# EAGLE design ASM4001 (EAGLE 6.3)
DATABASE: ./../../../../../Components/TinyCircuits_Part_Database.txt

## Sheet 1 of 2
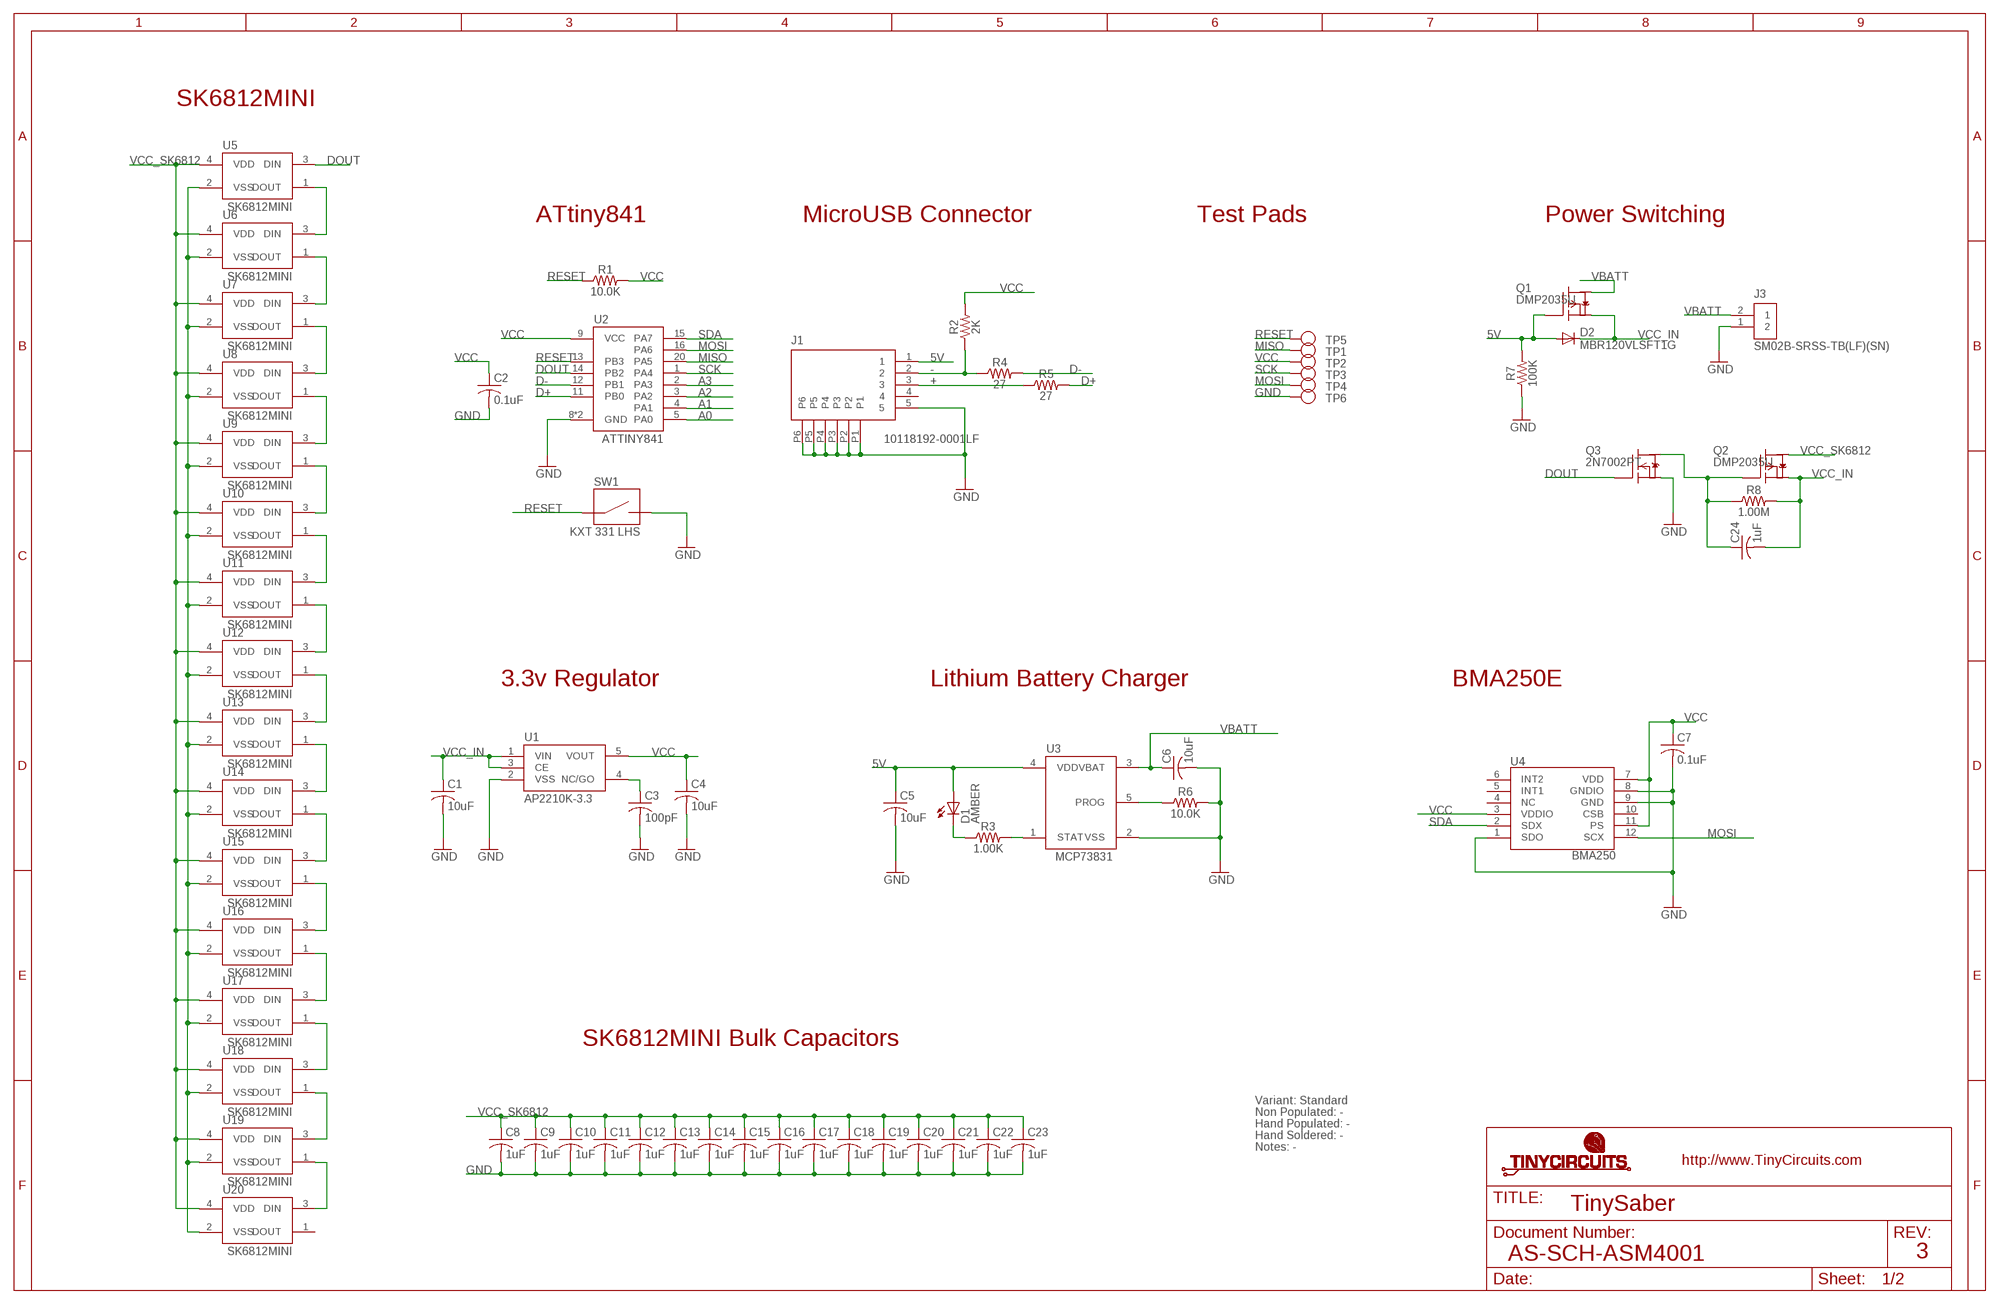
[diagram p0: schematic, sheet 1]

### Parts
C1  10uF  AS-ITM-00002  [C0603]
C2  0.1uF  AS-ITM-00008  [C0402]
C3  100pF  AS-ITM-00148  [0402]
C4  10uF  AS-ITM-00002  [C0603]
C5  10uF  AS-ITM-00002  [C0603]
C6  10uF  AS-ITM-00002  [C0603]
C7  0.1uF  AS-ITM-00008  [C0402]
C8  1uF  AS-ITM-00410  [C0603]
C9  1uF  AS-ITM-00410  [C0603]
C10  1uF  AS-ITM-00410  [C0603]
C11  1uF  AS-ITM-00410  [C0603]
C12  1uF  AS-ITM-00410  [C0603]
C13  1uF  AS-ITM-00410  [C0603]
C14  1uF  AS-ITM-00410  [C0603]
C15  1uF  AS-ITM-00410  [C0603]
C16  1uF  AS-ITM-00410  [C0603]
C17  1uF  AS-ITM-00410  [C0603]
C18  1uF  AS-ITM-00410  [C0603]
C19  1uF  AS-ITM-00410  [C0603]
C20  1uF  AS-ITM-00410  [C0603]
C21  1uF  AS-ITM-00410  [C0603]
C22  1uF  AS-ITM-00410  [C0603]
C23  1uF  AS-ITM-00410  [C0603]
C24  1uF  AS-ITM-00105  [C0402]
D1  AMBER  AS-ITM-00058  [0402_LED]
D2  MBR120VLSFT1G  AS-ITM-00111  [SOD-123FL]
J1  10118192-0001LF  AS-ITM-00021A  [MICRO_USB_ALT]
J3  SM02B-SRSS-TB(LF)(SN)  AS-ITM-00231  [JST_SH_2X1]
Q1  DMP2035U  AS-ITM-00024  [SOT23]
Q2  DMP2035U  AS-ITM-00024A  [SOT23A]
Q3  2N7002PT  AS-ITM-00110  [SOT-416]
R1  10.0K  AS-ITM-00032  [0402]
R2  2K  AS-ITM-00315  [0402]
R3  1.00K  AS-ITM-00003  [0402]
R4  27  AS-ITM-00240  [0402]
R5  27  AS-ITM-00240  [0402]
R6  10.0K  AS-ITM-00032  [0402]
R7  100K  AS-ITM-00004  [0402]
R8  1.00M  AS-ITM-00005  [0402]
SW1  KXT 331 LHS  AS-ITM-00372  [KXT_LHS]
TP1  TEST_POINT  [TEST_POINT_1MM]
TP2  TEST_POINT  [TEST_POINT_1MM]
TP3  TEST_POINT  [TEST_POINT_1MM]
TP4  TEST_POINT  [TEST_POINT_1MM]
TP5  TEST_POINT  [TEST_POINT_1MM]
TP6  TEST_POINT  [TEST_POINT_1MM]
U1  AP2210K-3.3  AS-ITM-00344  [SOT-25]
U2  ATTINY841  AS-ITM-00255  [VQFN-20]
U3  MCP73831  AS-ITM-00136  [SOT-23]
U4  BMA250  AS-ITM-00070  [3-AXIS_ACCELEROMETER]
U5  SK6812MINI  AS-ITM-00343  [SK6812MINI]
U6  SK6812MINI  AS-ITM-00343  [SK6812MINI]
U7  SK6812MINI  AS-ITM-00343  [SK6812MINI]
U8  SK6812MINI  AS-ITM-00343  [SK6812MINI]
U9  SK6812MINI  AS-ITM-00343  [SK6812MINI]
U10  SK6812MINI  AS-ITM-00343  [SK6812MINI]
U11  SK6812MINI  AS-ITM-00343  [SK6812MINI]
U12  SK6812MINI  AS-ITM-00343  [SK6812MINI]
U13  SK6812MINI  AS-ITM-00343  [SK6812MINI]
U14  SK6812MINI  AS-ITM-00343  [SK6812MINI]
U15  SK6812MINI  AS-ITM-00343  [SK6812MINI]
U16  SK6812MINI  AS-ITM-00343  [SK6812MINI]
U17  SK6812MINI  AS-ITM-00343  [SK6812MINI]
U18  SK6812MINI  AS-ITM-00343  [SK6812MINI]
U19  SK6812MINI  AS-ITM-00343  [SK6812MINI]
U20  SK6812MINI  AS-ITM-00343  [SK6812MINI]

### Nets
5V: C5.1 D1.1(A) D2.A J1.1 Q1.B(G) R7.2 U3.4(VDD)
+: J1.3 R5.1
-: J1.2 R2.1 R4.1
A0: U2.5(PA0)
A1: U2.4(PA1)
A2: U2.3(PA2)
A3: U2.2(PA3)
D+: R5.2 U2.11(PB0)
D-: R4.2 U2.12(PB1)
DOUT: Q3.1(G) U2.14(PB2) U5.3(DIN)
GND: C1.2 C2.2 C3.2 C4.2 C5.2 C6.2 C7.2 C8.2 C9.2 C10.2 C11.2 C12.2 C13.2 C14.2 C15.2 C16.2 C17.2 C18.2 C19.2 C20.2 C21.2 C22.2 C23.2 J1.5 J1.P1 J1.P2 J1.P3 J1.P4 J1.P5 J1.P6 J3.1 Q3.2(S) R6.2 R7.1 SW1.2 TP6.P$1 U1.2(VSS) U2.8(GND) U2.PAD(GND) U3.2(VSS) U4.1(SDO) U4.8(GNDIO) U4.9(GND) U5.2(VSS) U6.2(VSS) U7.2(VSS) U8.2(VSS) U9.2(VSS) U10.2(VSS) U11.2(VSS) U12.2(VSS) U13.2(VSS) U14.2(VSS) U15.2(VSS) U16.2(VSS) U17.2(VSS) U18.2(VSS) U19.2(VSS) U20.2(VSS)
MISO: TP1.P$1 U2.20(PA5)
MOSI: TP4.P$1 U2.16(PA6) U4.12(SCX)
N$1: C3.1 U1.4(NC/GO)
N$2: U17.1(DOUT) U18.3(DIN)
N$3: U18.1(DOUT) U19.3(DIN)
N$4: U6.1(DOUT) U7.3(DIN)
N$5: C24.1 Q2.B(G) Q3.3(D) R8.1
N$6: U19.1(DOUT) U20.3(DIN)
N$7: R6.1 U3.5(PROG)
N$9: U5.1(DOUT) U6.3(DIN)
N$10: U7.1(DOUT) U8.3(DIN)
N$13: U8.1(DOUT) U9.3(DIN)
N$14: R3.2 U3.1(STAT)
N$15: D1.2(C) R3.1
N$16: U9.1(DOUT) U10.3(DIN)
N$19: U10.1(DOUT) U11.3(DIN)
N$22: U11.1(DOUT) U12.3(DIN)
N$25: U12.1(DOUT) U13.3(DIN)
N$28: U13.1(DOUT) U14.3(DIN)
N$31: U14.1(DOUT) U15.3(DIN)
N$34: U15.1(DOUT) U16.3(DIN)
N$37: U16.1(DOUT) U17.3(DIN)
RESET: R1.1 SW1.1 TP5.P$1 U2.13(PB3)
SCK: TP3.P$1 U2.1(PA4)
SDA: U2.15(PA7) U4.2(SDX)
VBATT: C6.1 J3.2 Q1.C(D) U3.3(VBAT)
VCC: C2.1 C4.1 C7.1 R1.2 R2.2 TP2.P$1 U1.5(VOUT) U2.9(VCC) U4.3(VDDIO) U4.7(VDD) U4.11(PS)
VCC_IN: C1.1 C24.2 D2.C Q1.E(S) Q2.E(S) R8.2 U1.1(VIN) U1.3(CE)
VCC_SK6812: C8.1 C9.1 C10.1 C11.1 C12.1 C13.1 C14.1 C15.1 C16.1 C17.1 C18.1 C19.1 C20.1 C21.1 C22.1 C23.1 Q2.C(D) U5.4(VDD) U6.4(VDD) U7.4(VDD) U8.4(VDD) U9.4(VDD) U10.4(VDD) U11.4(VDD) U12.4(VDD) U13.4(VDD) U14.4(VDD) U15.4(VDD) U16.4(VDD) U17.4(VDD) U18.4(VDD) U19.4(VDD) U20.4(VDD)
Unconnected: J1.4 U4.4(NC) U4.5(INT1) U4.6(INT2) U4.10(CSB) U20.1(DOUT)

### Notes on the sheet
- SK6812MINI
- ATtiny841 | MicroUSB Connector | Test Pads | Power Switching
- 3.3v Regulator | Lithium Battery Charger | BMA250E
- SK6812MINI Bulk Capacitors
- Variant: Standard
- Non Populated: -
- Hand Populated: -
- Hand Soldered: -
- Notes: -
- TinySaber
- AS-SCH-ASM4001 | 3

## Sheet 2 of 2

## Library data of the parts
C1 C4-C6 = tinycircuits:AS-ITM-00002: CAP CER 10UF 10V 20% X5R 0603; PARTNO: AS-ITM-00002
C2 C7 = tinycircuits:AS-ITM-00008: CAP CER 0.1UF 16V 10% X5R 0402; PARTNO: AS-ITM-00008
C3 = tinycircuits:AS-ITM-00148: CAP CER 100PF 50V 5% NPO 0402; PARTNO: AS-ITM-00148
C8-C23 = tinycircuits:AS-ITM-00410: CAP CER 1UF 10V X5R 0603; PARTNO: AS-ITM-00410
C24 = tinycircuits:AS-ITM-00105: CAP CER 1UF 6.3V 10% X5R 0402; PARTNO: AS-ITM-00105
D1 = tinycircuits:AS-ITM-00058: LED 0402 AMBER WTR CLR SMD; PARTNO: AS-ITM-00058
D2 = tinycircuits:AS-ITM-00111: DIODE SCHOTTKY 20V 1A SOD123L; PARTNO: AS-ITM-00111
J1 = tinycircuits:AS-ITM-00021: CONN RCPT 5POS MICRO USB R/A; PARTNO: AS-ITM-00021; PNPROTATION: 90
J3 = tinycircuits:AS-ITM-00231: CONN HEADER SH 2POS SIDE 1MM; PARTNO: AS-ITM-00231; PNPROTATION: 180
Q1 = tinycircuits:AS-ITM-00024: P-Channel MOSFET SOT-23; PARTNO: AS-ITM-00024; PNPROTATION: 0
Q2 = tinycircuits:AS-ITM-00024: P-Channel MOSFET SOT-23; PARTNO: AS-ITM-00024
Q3 = tinycircuits:AS-ITM-00110: MOSFET N-CH SGL 60V SOT-416; PARTNO: AS-ITM-00110
R1 R6 = tinycircuits:AS-ITM-00032: RES 10.0K OHM 1/16W 1% 0402 SMD; PARTNO: AS-ITM-00032
R2 = tinycircuits:AS-ITM-00315: RES SMD 2K OHM 1% 1/16W 0402; PARTNO: AS-ITM-00315
R3 = tinycircuits:AS-ITM-00003: RES 1.00K OHM 1/16W 1% 0402; PARTNO: AS-ITM-00003
R4 R5 = tinycircuits:AS-ITM-00240: RES 27 OHM 1/16W 5% 0402 SMD; PARTNO: AS-ITM-00240; VALUE: 27.0
R7 = tinycircuits:AS-ITM-00004: RES 100K OHM 1/16W 1% 0402; PARTNO: AS-ITM-00004
R8 = tinycircuits:AS-ITM-00005: RES 1.00M OHM 1/16W 1% 0402; PARTNO: AS-ITM-00005
SW1 = tinycircuits:AS-ITM-00372: SWITCH TACTILE SPST-NO 0.02A 15V; PARTNO: AS-ITM-00372
TP1-TP6 = tinycircuits:TEST_POINT: Test point, no drill
U1 = tinycircuits:AS-ITM-00344: IC REG LDO 3.3V 0.3A SOT25; PARTNO: AS-ITM-00344; PNPROTATION: 270; VALUE: AP2210K-3.3TRG1
U2 = tinycircuits:AS-ITM-00255: IC MCU 8BIT 8KB FLASH 20VQFN; PARTNO: AS-ITM-00255
U3 = tinycircuits:AS-ITM-00136: IC CONTROLLER LI-ION 4.2V SOT23-5; PARTNO: AS-ITM-00136; PNPROTATION: 270
U4 = tinycircuits:AS-ITM-00070: 3-AXIS ACCELEROMOETER; PARTNO: AS-ITM-00070; PNPROTATION: 90
U5-U20 = tinycircuits:AS-ITM-00343: RGB LED WITH DRIVER MINI 3535; PARTNO: AS-ITM-00343

## Board
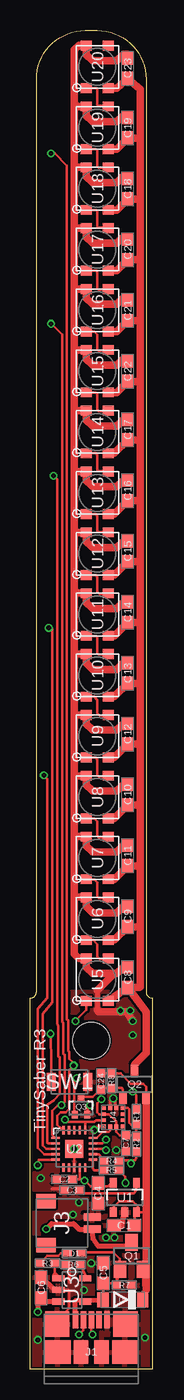
[diagram p1: board, top side]
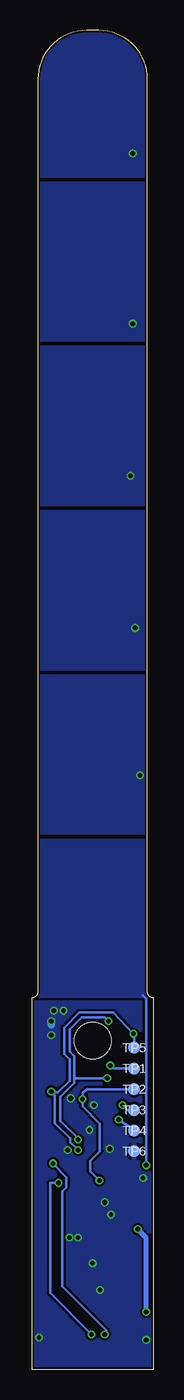
[diagram p2: board, bottom side, seen from below]

Size 10 x 110 mm. Coordinates in mm from the lower left corner, seen from the top.
Outline: 0.5,106 arc-90 4.5,110 5.5,110 arc-90 9.5,106 9.5,31 arc90 10,30.5 10,0 0,0 0,30.5 arc90 0.5,31 0.5,106
Copper layers (1*16): Top 0.035mm / dielectric 1.5mm / Bottom 0.035mm
Design rules "default *": minimum track width 7mil, minimum drill 15mil, track to track 7mil, track to pad 7mil, pad to pad 7mil, via to via 7mil, smd to smd 7mil, copper to edge 7mil, drill to drill 8mil, minimum pad ring 8mil, minimum via ring 5mil, stop-mask expansion 4mil, vias tented up to drill 25mil, thermal gap 10mil
Holes 3 mm at 5,27
tRestrict: 5 lines

### Footprints (pad centres in the part's own frame; a part is rotated, then mirrored left to right if it is on the bottom)
C0603 = smd 1.1 x 1: 1 -0.85,0; 2 0.85,0
C0402 = smd 0.65 x 0.6: 1 -0.65,0; 2 0.65,0
0402 = smd 0.65 x 0.55: 1 -0.6,0; 2 0.6,0
0402_LED = smd 0.7 x 0.5: 1 -0.55,0; 2 0.55,0
SOD-123FL = smd 0.914 x 1.219: A 1.638,0; C -1.638,0
MICRO_USB_ALT = smd 1.38 x 0.45: 1 2.66,1.3; 2 2.66,0.65; 3 2.66,0; 4 2.66,-0.65; 5 2.66,-1.3 | smd 2.1 x 2: P1 2.3,-2.8; P2 2.3,2.8 | smd 1.9 x 2.1: P3 0,2.75; P4 0,-2.75 | smd 1.9 x 1.175: P5 0,0.838; P6 0,-0.838
JST_SH_2X1 = smd 0.6 x 1.4: 1 -0.5,2.475; 2 0.5,2.475 | smd 1.2 x 1.6: PAD1 -1.8,-1.325; PAD2 1.8,-1.325
SOT23 = smd 1 x 1.4: B -0.95,-1.1; C 0,1.1; E 0.95,-1.1
SOT23A = smd 0.6 x 1: B -0.95,-1.1; C 0,1.1; E 0.95,-1.1
SOT-416 = smd 0.5 x 0.6: 1 -0.5,-0.65; 2 0.5,-0.65; 3 0,0.65
KXT_LHS = smd 1.5 x 0.75: 1 0,1.5; 2 0,-1.5
TEST_POINT_1MM = smd 1 x 1: P$1 0,0
SOT-25 = smd 0.55 x 0.8: 1 -0.95,-1.2; 2 0,-1.2; 3 0.95,-1.2; 4 0.95,1.2; 5 -0.95,1.2
VQFN-20 = smd 0.7 x 0.2: 1 -1.55,0.9; 2 -1.55,0.45; 3 -1.55,0; 4 -1.55,-0.45; 5 -1.55,-0.9; 11 1.55,-0.9; 12 1.55,-0.45; 13 1.55,0; 14 1.55,0.45; 15 1.55,0.9 | smd 0.2 x 0.7: 6 -0.9,-1.55; 7 -0.45,-1.55; 8 0,-1.55; 9 0.45,-1.55; 10 0.9,-1.55; 16 0.9,1.55; 17 0.45,1.55; 18 0,1.55; 19 -0.45,1.55; 20 -0.9,1.55 | smd 1.5 x 1.5: PAD 0,0
SOT-23 = smd 0.5 x 1: 1 -0.95,-1.1; 2 0,-1.1; 3 0.95,-1.1; 4 0.95,1.1; 5 -0.95,1.1
3-AXIS_ACCELEROMETER = smd 0.3 x 0.35: 1 -0.75,0.775; 4 -0.75,-0.775; 5 -0.25,-0.775; 6 0.25,-0.775; 7 0.75,-0.775; 10 0.75,0.775; 11 0.25,0.775; 12 -0.25,0.775 | smd 0.35 x 0.3: 2 -0.775,0.25; 3 -0.775,-0.25; 8 0.775,-0.25; 9 0.775,0.25
SK6812MINI = smd 0.8 x 0.9: 1 -1.75,0.9; 2 -1.75,-0.9; 3 1.75,-0.9; 4 1.75,0.9

### Placement (x,y rotation side)
C1  7.7,11.8 180 top
C2  2.8,15.6 180 top
C3  3.4,14.7 180 top
C4  5.55,14.45 270 top
C5  6,7.9 90 top
C6  0.9,6.7 90 top
C7  7.85,18.55 270 top
C8  8,32.2 90 top
C9  8,37.2 90 top
C10  8,47.2 90 top
C11  8,42.2 90 top
C12  8,52.2 90 top
C13  8,57.2 90 top
C14  8,62.2 90 top
C15  8,67.2 90 top
C16  8,72.2 90 top
C17  8,77.2 90 top
C18  8,97 90 top
C19  8,102 90 top
C20  8,92 90 top
C21  8,87 90 top
C22  8,82 90 top
C23  8,106.9 90 top
C24  5.8,23.65 90 top
D1  3.6,9.5 180 top
D2  7.6,5.7 180 top
J1  5,1.4 90 top
J3  2.6,12 270 top
Q1  8.3,9.3 0 top
Q2  8.55,23.4 0 top
Q3  4.15,21.55 0 top
R1  8.7,20.75 270 top
R2  8.7,18.5 90 top
R3  1.4,8.7 0 top
R4  6.65,17.1 180 top
R5  6.65,16.35 180 top
R6  3.5,8.6 180 top
R7  7.7,6.9 180 top
R8  6.65,23.7 90 top
SW1  3.2,23.6 90 top
TP1  1.6,24.7 0 bottom
TP2  1.6,23 0 bottom
TP3  1.6,21.3 0 bottom
TP4  1.6,19.6 0 bottom
TP5  1.6,26.4 0 bottom
TP6  1.6,17.9 0 bottom
U1  7.75,14.1 0 top
U2  3.6,18.1 0 top
U3  3.4,6.5 270 top
U4  6.8,20.7 90 top
U5  5.5,32 270 top
U6  5.5,37 270 top
U7  5.5,42 270 top
U8  5.5,47 270 top
U9  5.5,52 270 top
U10  5.5,57 270 top
U11  5.5,62 270 top
U12  5.5,67 270 top
U13  5.5,72 270 top
U14  5.5,77 270 top
U15  5.5,82 270 top
U16  5.5,87 270 top
U17  5.5,92 270 top
U18  5.5,97 270 top
U19  5.5,102 270 top
U20  5.5,107 270 top
U$1  [DOCFIELD-TINYCIRCUITS-PCB]  22,-2 0 top  (outside the outline)

### Tracks (layer width: path | path; a pad name or v marks a point on that pad's centre or on a via)
5V
  Top 0.203: Q1.B 7.35,9.05 6.8,9.6 4.25,9.6 D1.1 | Q1.B 7.1,7.05 C5.1 5.96,7.01 D2.A | 3.7,5.64 4.41,5.64 U3.4 | R7.2 7.1,7.95 Q1.B
  Top 0.406: J1.1 3.7,5.64 D2.A
+  (via drill 0.38)
  Top 0.203: v5.1,2.85 5,2.95 J1.3 | R5.1 7.8,15.8 v7.8,15.3
  Bottom 0.203: v7.8,15.3 8.5,15.3 8.5,6.25 v5.1,2.85
-  (via drill 0.38)
  Top 0.203: v4,2.85 4.35,3.2 J1.2 | R4.1 7,17.15 8.05,17.15 | 8.05,17.15 v8.25,16.9 | R2.1 8.7,17.3 8.55,17.15 8.05,17.15
  Bottom 0.203: v4,2.85 3.9,3 3.9,3.2 7.5,6.8 7.5,14.6 7.15,14.95 7.15,15.75 8.25,16.85 v8.25,16.9
A0  (via drill 0.38)
  Top 0.203: U2.5 0.7,17.2 v0.6,16.75
  Bottom 0.203: v0.6,16.75 0.6,30.4 0.9,30.7
  pour Bottom: 0,43.5 10,43.5 10,30.6 0,30.6
A1  (via drill 0.38)
  Top 0.203: U2.4 1.15,17.65 0.6,18.2 0.6,29.6 1.4,30.5 1.4,48.5 v1.1,48.8
  pour Bottom: 0,57 10,57 10,44 0,44
A2  (via drill 0.38)
  Top 0.203: U2.3 1.3,18.1 1,18.4 1,29.2 1.8,30.15 1.8,60.8 v1.5,60.9
  pour Bottom: 0,70.5 10,70.5 10,57.5 0,57.5
A3  (via drill 0.38)
  Top 0.203: U2.2 1.45,18.55 1.4,18.6 1.4,21.7 1.9,22.1 2.4,22.6 2.4,25.6 2.3,25.7 2.3,28.2 2.2,28.35 2.2,73.1 v1.9,73.4
  pour Bottom: 0,84 10,84 10,71 0,71
D+
  Top 0.203: U2.11 5,17.2 5.1,17.1 5.1,16.5 5.25,16.35 R5.2
D-
  Top 0.203: U2.12 5.6,17.65 R4.2
DOUT  (via drill 0.38)
  Top 0.203: U2.14 5.9,18.55 v6.2,18.85 | Q3.1 3.6,20.9 3.6,23.7 v3.8,23.9 | v3.7,28.6 4.6,29.5 U5.3
  Bottom 0.203: v6.2,18.85 6.2,18.95 7.65,20.4 7.65,22.35 6.5,23.5 6.5,23.9 | v3.7,28.6 4,28.9 5.9,28.9 6.9,27.9 6.9,26.1 6.5,25.7 6.5,23.9 | v3.8,23.9 6.5,23.9
GND  (via drill 0.38)
  Top 0.203: U4.9 6.55,22.05 6.6,22.1 6.8,22.1 | J1.P2 2.2,4 3.2,5 3.2,6.4 3.1,6.5 U3.2 1.95,6.5 | U2.8 U2.PAD | C1.2 7.25,11.8 7.5,11.75 | U4.1 5.55,19.95 v5.25,19.65 | v6.8,22.25 6.98,22.12 6.98,21.73 7.05,21.5 U4.8 | Q3.2 4.7,21.45 v4.9,21.7
  Top 0.254: R6.2 3.2,8.3 3.2,7.1
  Top 0.305: 2.7,14.8 1.8,14.8
  Top 0.406: 5.5,31.1 5.5,29.5 | 1.95,6.5 C6.2 | U1.2 7.75,12.75 7.6,12.4 7.5,11.75
  Top 0.61: 3.6,38.8 3.6,34.1 3.95,33.75 U5.2 4.6,33 5.1,32.5 6.9,32.5 | 3.6,38.8 3.6,43.9 | 3.6,43.9 3.6,48.8 | 3.6,48.8 3.6,53.8 | 3.6,53.8 3.6,58.9 | 3.6,58.9 3.6,64 | 3.6,64 3.6,68.8 | 3.6,68.8 3.6,73.9 | 3.6,73.9 3.6,78.9 | 3.6,78.9 3.6,83.7 | 3.6,83.7 3.6,88.9 | 3.6,88.9 3.6,93.9 | 3.6,93.9 3.6,98.9 | 3.6,98.9 3.6,104 | 3.6,104 3.6,108.4 4,108.8 4.55,108.8 U20.2 4.6,108 5.1,107.5 7.1,107.5 7.65,108.05 8,108.05 C23.2 | 3.6,43.9 3.75,43.75 U7.2 4.6,43 5.1,42.5 7.1,42.5 7.65,43.05 C11.2 | 3.6,48.8 3.65,48.75 U8.2 4.6,48 5.1,47.5 7.1,47.5 7.65,48.05 C10.2 | 3.6,53.8 3.65,53.75 U9.2 4.6,53 5.1,52.5 7.1,52.5 7.65,53.05 C12.2 | 3.6,58.9 3.75,58.75 U10.2 4.6,58 5.1,57.5 7.1,57.5 7.65,58.05 C13.2 | 3.6,64 3.85,63.75 U11.2 4.6,63 5.1,62.5 7.1,62.5 7.65,63.05 C14.2 | 3.6,68.8 3.65,68.75 U12.2 4.6,68 5.1,67.5 7.1,67.5 7.65,68.05 C15.2 | 3.6,73.9 3.75,73.75 U13.2 4.6,73 5.1,72.5 7.1,72.5 7.65,73.05 C16.2 | 3.6,78.9 3.75,78.75 U14.2 4.6,78 5.1,77.5 7.1,77.5 7.65,78.05 C17.2 | 3.6,83.7 3.65,83.75 U15.2 4.6,83 5.1,82.5 7.1,82.5 7.65,83.05 8,83.05 C22.2 | 3.6,88.9 3.75,88.75 U16.2 4.6,88 5.1,87.5 7.1,87.5 7.65,88.05 8,88.05 C21.2 | 3.6,93.9 3.75,93.75 U17.2 4.6,93 5.1,92.5 7.1,92.5 7.65,93.05 8,93.05 C20.2 | 3.6,98.9 3.75,98.75 U18.2 4.6,98 5.1,97.5 7.1,97.5 7.65,98.05 8,98.05 C18.2 | 3.6,104 3.85,103.75 U19.2 4.6,103 5.1,102.5 7.1,102.5 7.65,103.05 8,103.05 C19.2 | C8.2 7.65,33.05 7.1,32.5 6.9,32.5 | 6.9,32.5 5.5,31.1 | 5.5,29.5 5.6,29.35 7.9,29.35 v8.4,28.6 | C9.2 7.65,38.05 7.1,37.5 5.1,37.5 4.6,38 4.6,38.7 | 4.6,38.7 U6.2 | 4.6,38.7 4.5,38.8 3.6,38.8
  Bottom 0.61: v8.4,28.6 8.4,28.3
  other vias: 4,13.7 9.4,2.6 5,8.7 3.5,12.7 6.9,10.8 4.4,6.5 0.6,2.4 0.85,15.7 3.6,18.1 8.2,29.45 7.4,29.45 8.4,27.45 6.2,10.8 7.05,18
  pour Bottom: 0,30.1 10,30.1 10,0 0,0
  pour Top: 0,31 10,31 10,0 0,0
MISO  (via drill 0.38)
  Top 0.203: v1.7,99.9 2,99.9 3,98.9 3,28.75 3.1,28.65 3.1,26.15 3.2,26.05 3.2,25.5 3.55,25.15 v3.55,24.95 3.2,24.6 3.2,21.4 2.9,21.1 2.5,21.1 2.2,20.8 2.2,20.05 2.4,19.85 U2.20
  Bottom 0.203: TP1.P$1 3.3,24.7 v3.55,24.95
  pour Bottom: 0,111 10,111 10,98 0,98
MOSI  (via drill 0.38)
  Top 0.203: U2.16 4.5,20.3 | 4.5,20.3 5.25,20.3 5.4,20.45 U4.12 | 4.5,20.3 2.85,20.3 v2.85,20.5
  Bottom 0.203: TP4.P$1 1.6,19.65 v2.85,20.5
N$1
  Top 0.203: U1.4 8.7,14.7 8.5,14.45 4.1,14.45 4,14.6 C3.1
N$2
  Top 0.203: U17.1 6.35,93.8 5.6,93.8 5.5,93.9 5.5,95.2 5.45,95.25 U18.3
N$3
  Top 0.203: U18.1 6.35,98.7 5.6,98.7 5.5,98.8 5.5,100.1 5.35,100.25 U19.3
N$4
  Top 0.203: U6.1 6.35,38.7 5.6,38.7 5.5,38.8 5.5,40 5.25,40.25 U7.3
N$5
  Top 0.203: Q2.B 7.6,23 7.5,23.1 R8.1 6,23.1 C24.1 5.75,23 5.1,22.35 4.25,22.35 Q3.3
N$6
  Top 0.203: U19.1 6.35,103.8 5.6,103.8 5.5,103.9 5.5,105.2 5.45,105.25 U20.3
N$7
  Top 0.203: R6.1 4.6,7.55 U3.5
N$9
  Top 0.203: U5.1 6.35,33.7 5.7,33.7 5.5,33.9 5.5,34.9 5.15,35.25 U6.3
N$10
  Top 0.203: U7.1 6.35,43.7 5.6,43.7 5.5,43.8 5.5,45 5.25,45.25 U8.3
N$13
  Top 0.203: U8.1 6.35,48.7 5.6,48.7 5.5,48.8 5.5,50.1 5.35,50.25 U9.3
N$14
  Top 0.203: 2,7.75 R3.2
  Top 0.406: U3.1 2,7.75
N$15
  Top 0.203: D1.2 2.5,9.5 2.3,9.3 1.4,9.3 R3.1
N$16
  Top 0.203: U9.1 6.35,53.7 5.7,53.7 5.5,53.9 5.5,55 5.25,55.25 U10.3
N$19
  Top 0.203: U10.1 6.35,58.7 5.6,58.7 5.5,58.8 5.5,60.1 5.35,60.25 U11.3
N$22
  Top 0.203: U11.1 6.35,63.7 5.7,63.7 5.5,63.9 5.5,65.1 5.35,65.25 U12.3
N$25
  Top 0.203: U12.1 6.35,68.8 5.6,68.8 5.5,68.9 5.5,70.1 5.35,70.25 U13.3
N$28
  Top 0.203: U13.1 6.35,73.8 5.6,73.8 5.5,73.9 5.5,75.1 5.35,75.25 U14.3
N$31
  Top 0.203: U14.1 6.35,78.7 5.6,78.7 5.5,78.8 5.5,80.1 5.35,80.25 U15.3
N$34
  Top 0.203: U15.1 6.35,83.7 5.6,83.7 5.5,83.8 5.5,85 5.25,85.25 U16.3
N$37
  Top 0.203: U16.1 6.35,88.7 5.6,88.7 5.5,88.8 5.5,90.2 5.45,90.25 U17.3
RESET  (via drill 0.38)
  Top 0.203: U2.13 6,18.1 6.15,18 v6.2,18 | SW1.1 1.7,25.1 v1.65,27.55 | R1.1 8.7,22.5 v8.4,22.8
  Bottom 0.203: v8.4,22.8 8.4,22.75 | v6.2,18 6.85,18.65 6.85,18.95 8.1,20.2 8.1,22.5 v8.4,22.8 | v8.4,22.8 8.35,22.75 7.85,22.75 6.9,23.7 6.9,25.45 7.35,25.9 7.35,28.05 6.1,29.3 3.3,29.3 v1.65,27.55 1.6,27.5 TP5.P$1
SCK  (via drill 0.38)
  Top 0.203: U2.1 1.8,19.25 1.8,21.2 2.3,21.7 v2.55,21.7 2.8,21.95 2.8,25.8 2.7,25.9 2.7,28.45 2.6,28.55 2.6,85 v1.7,85.9
  Bottom 0.203: TP3.P$1 2.15,21.3 v2.55,21.7
  pour Bottom: 0,97.5 10,97.5 10,84.5 0,84.5
SDA
  Top 0.203: U2.15 5.45,19 5.95,19.5 6.45,19.5 6.55,19.6 U4.2
VBATT  (via drill 0.38)
  Top 0.203: U3.3 1.2,5.55 C6.1
  Top 0.406: U3.3 0.7,5.55 0.7,5.5 0.6,5.5 v0.6,4.7 | v1.3,11.5 1.75,11.95 3.55,11.95 4,11.5 J3.2 5.15,10.7 5.55,10.1 7.9,10.1 Q1.C
  Bottom 0.406: v0.6,4.7 0.6,10.8 v1.3,11.5
VCC  (via drill 0.38)
  Top 0.203: 7.6,21.48 U4.7 8,21.45 8.1,21.35 8.1,20.25 8.3,20.05 8.55,20.05 R1.2 R2.2 8.45,19.2 C7.1 7.35,19.2 7.05,19.5 U4.3 7.05,20.35 6.45,20.95 U4.11 5.65,20.95 5.5,21.1 5.5,21.85 v5.82,22.18 | 4.05,15.6 U2.9 | U1.5 6.7,15.3 6.4,15 5.55,15 | 4.4,15.6 4.05,15.6 | C2.1 4.05,15.6 | 4.6,15.6 4.4,15.6 | 5.55,15 4.95,15 v4.45,15.5 4.45,15.55 4.4,15.6 | 5.55,15 C4.1
  Bottom 0.203: v4.45,15.5 5.2,16.25 5.2,17.1 4.4,17.9 4.4,20.15 5.82,21.57 v5.82,22.18 5.8,22.2 5.8,22.7 5.5,23 TP2.P$1
VCC_IN
  Top 0.203: Q1.E 9.25,6.85 9.5,6.6 | U1.1 6.85,13.35 7.3,13.8 8.4,13.8 8.8,13.4 8.8,12.95 U1.3 | U1.3 9.5,12.9 | C1.1 8.55,12.75 U1.3 | C24.2 R8.2 7.4,24.3 8.25,23.45 9.25,23.45 9.5,23.2 Q2.E
  Top 0.406: D2.C 9.1,5.7 9.3,6.3 9.3,5.9 9.5,5.9 9.5,6.5
  Top 0.61: 9.5,6.5 9.5,6.6 9.5,12.9 Q2.E
VCC_SK6812
  Top 0.61: C8.1 9.5,29.35 9.5,26 8.55,25.05 Q2.C | U5.4 C8.1 | C8.1 8.95,31.35 9,31.4 9,36.2 | 9,36.2 9,41.2 | 9,41.2 9,46.2 | 9,46.2 9,51.3 | 9,51.3 9,56.5 | 9,56.5 9,61.2 | 9,61.2 9,66.2 | 9,66.2 9,71.2 | 9,71.2 9,76.3 | 9,76.3 9,81 | 9,81 9,86.3 | 9,86.3 9,91.1 | 9,91.1 9,96.2 | 9,96.2 9,101.2 | 9,101.2 9,105.15 C23.1 7.1,105.25 U20.4 | 9,101.2 8.95,101.15 C19.1 7.1,100.25 U19.4 | U18.4 7.1,95.25 C18.1 8.95,96.15 9,96.2 | U17.4 7.1,90.25 C20.1 8.95,91.15 9,91.1 | U16.4 7.1,85.25 C21.1 8.85,86.15 9,86.3 | U15.4 7.1,80.25 C22.1 8.85,81.15 9,81 | U14.4 6.9,75.25 C17.1 8.95,76.35 9,76.3 | U13.4 6.9,70.25 C16.1 8.85,71.35 9,71.2 | U12.4 6.9,65.25 C15.1 8.85,66.35 9,66.2 | U11.4 6.9,60.25 C14.1 8.85,61.35 9,61.2 | U10.4 6.9,55.25 C13.1 8.85,56.35 9,56.5 | U9.4 6.9,50.25 C12.1 8.95,51.35 9,51.3 | U8.4 6.9,45.25 C10.1 8.85,46.35 9,46.2 | U6.4 6.9,35.25 C9.1 8.85,36.35 9,36.2 | U7.4 6.9,40.25 C11.1 8.85,41.35 9,41.2

### Text on the board
tPlace: TinySaber R3
Document: FABRICATION DRAWING | NOTES: | 1. PRINTED CIRCUIT BOARD MADE FROM NEMA GRADE FR-4 EPOXY LAMINATE | WITH 1 OUNCE COPPER PLATING AND .024 THICKNESS. | 2. ALL DIMENSIONS ARE GIVEN IN INCHES. | 3. CIRCUIT PATHS ARE FOR REFERENCE ONLY. | 4. HOLE SIZES SHOWN ARE FINISHED DIAMETERS AFTER PLATING. | 5. BOARD PLATED USING REFLOW OR SIMILAR METHOD. | 6. BOARD TO HAVE BLUE SOLDER MASK ON PLATED SURFACES USING WET FILM | 7. SILKSCREEN BOARD USING WHITE INK. | SR100 OR SR1010 EPOXY. EQUIVALENT WET OR DRY FILM MAY BE USED. | 8. THE FOLLOWING INFORMATION APPLIES TO THIS BOARD: | * 2 COPPER LAYERS | * .024 BOARD THICKNESS | * REQUIRES TOP SIDE SILKSCREEN | TinySaber | AS-PCB-ASM4001 | 3